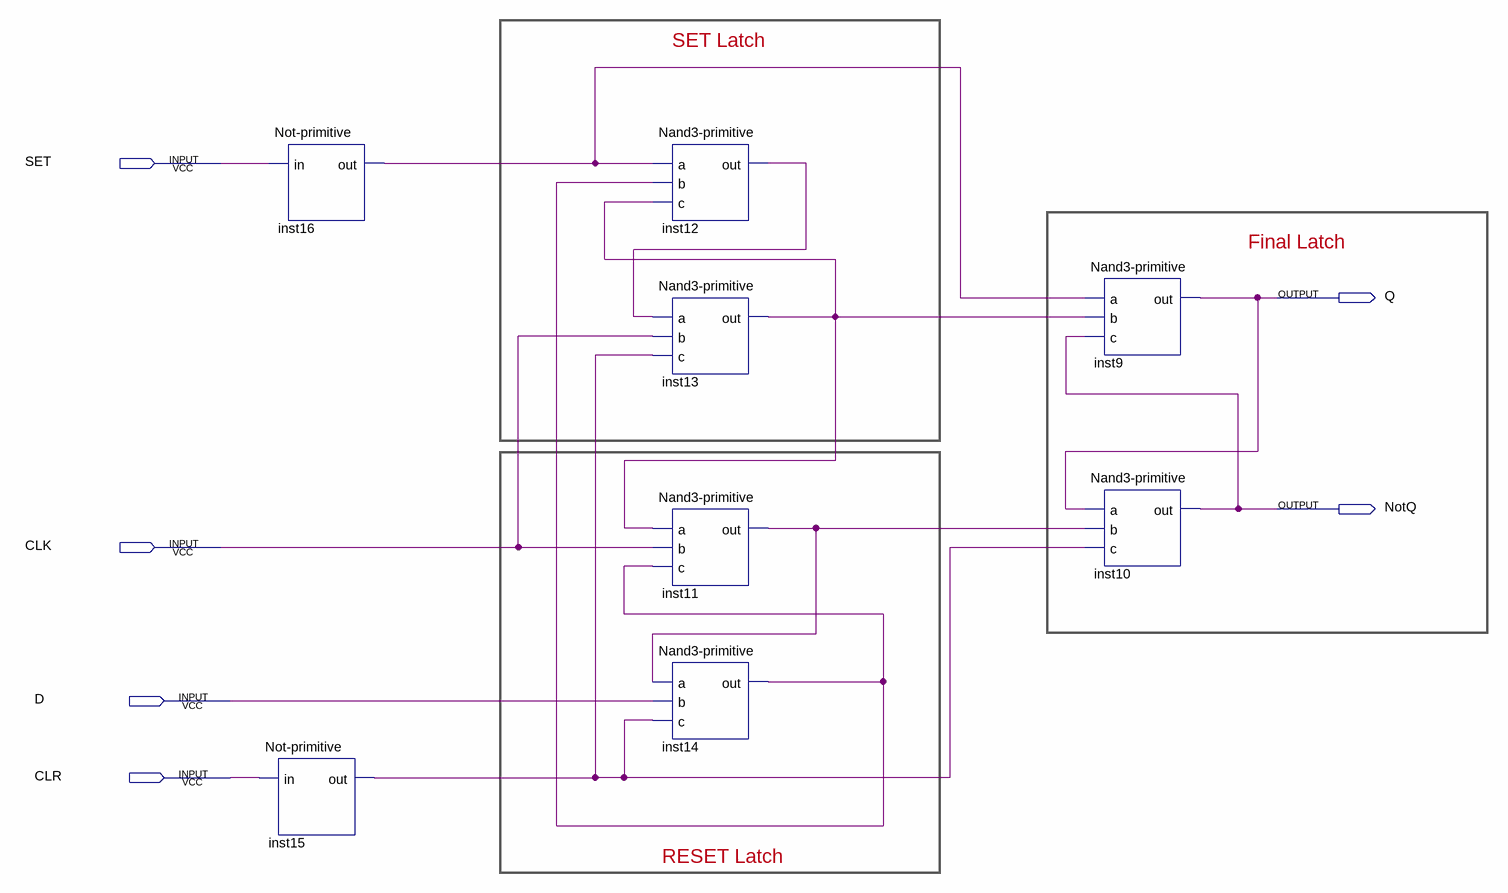
[diagram p0: schematic sheet]
// Quartus schematic DFlipFlop.bdf as structural Verilog: 8 symbols, 6 pins
module DFlipFlop (
  input  SET,
  input  CLK,
  input  D,
  input  CLR,
  output Q,
  output NotQ
);

  wire inst11_out, inst12_out, inst13_out, inst14_out, inst15_out, inst16_out;

  \Not-primitive  inst16 (.in(SET), .out(inst16_out));
  \Not-primitive  inst15 (.in(CLR), .out(inst15_out));
  \Nand3-primitive  inst12 (.a(inst16_out), .b(inst14_out), .c(inst13_out), .out(inst12_out));
  \Nand3-primitive  inst13 (.a(inst12_out), .b(CLK), .c(inst15_out), .out(inst13_out));
  \Nand3-primitive  inst11 (.a(inst13_out), .b(CLK), .c(inst14_out), .out(inst11_out));
  \Nand3-primitive  inst14 (.a(inst11_out), .b(D), .c(inst15_out), .out(inst14_out));
  \Nand3-primitive  inst9 (.a(inst16_out), .b(inst13_out), .c(NotQ), .out(Q));
  \Nand3-primitive  inst10 (.a(Q), .b(inst11_out), .c(inst15_out), .out(NotQ));

  // Notes on the sheet:
  //   SET Latch
  //   Final Latch
  //   RESET Latch
endmodule
